# Altium schematic sheet Collection.SchDoc
size A; SheetNumber: 1; SheetTotal: 4
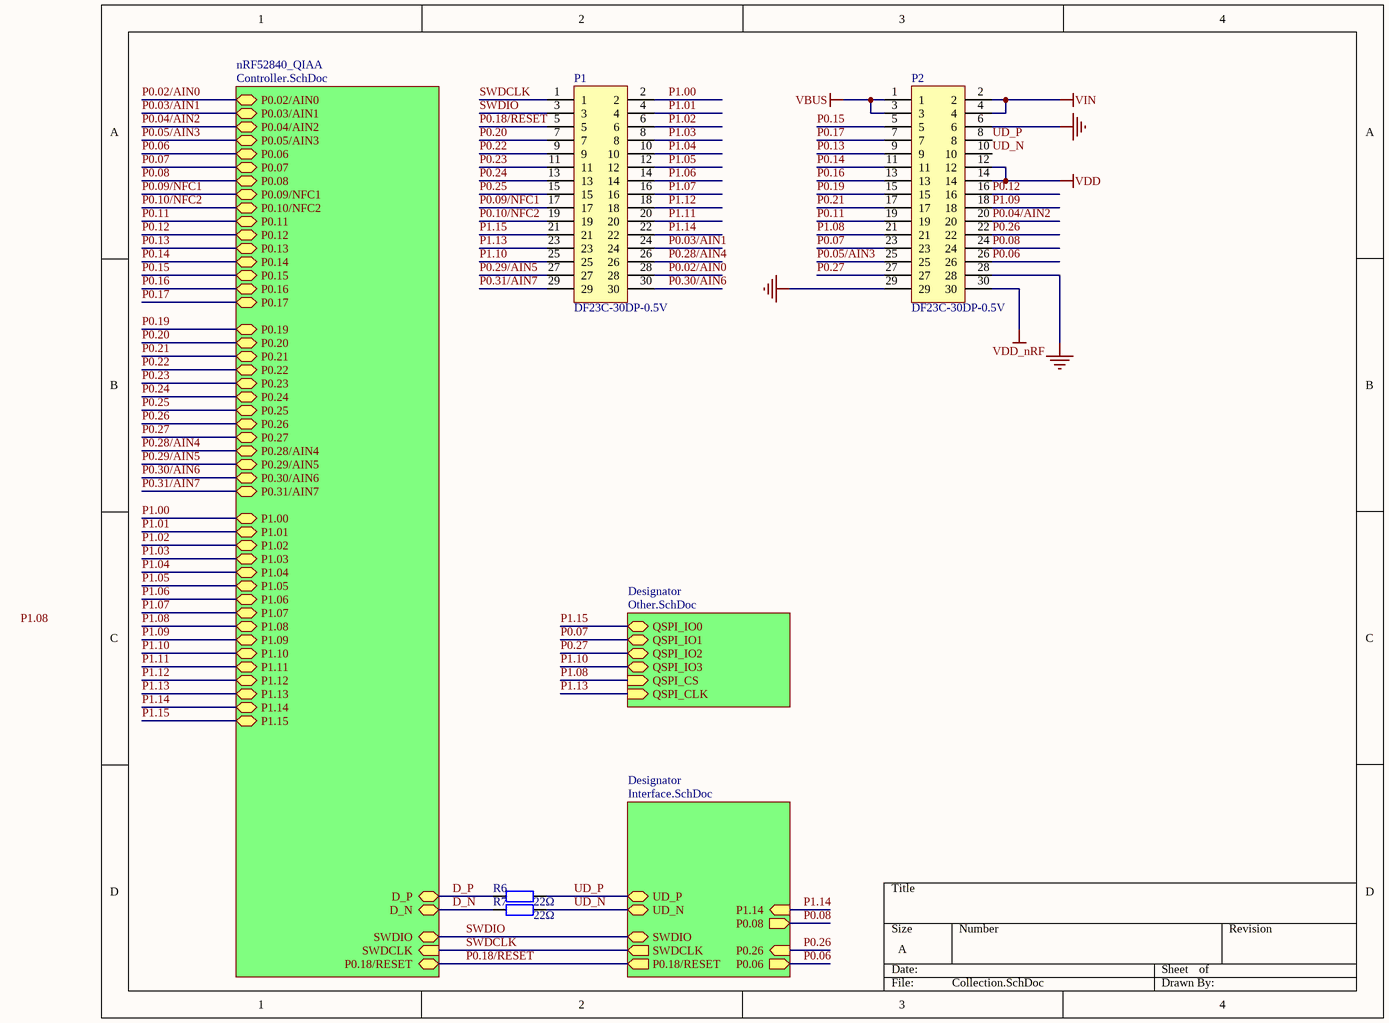
[diagram p0: Collection.SchDoc]

## Parts
P1  DF23C-30DP-0.5V  [DF23C-30DP-0.5V]
P2  DF23C-30DP-0.5V  [DF23C-30DP-0.5V]
R6  value 22Ω  [0402_R]  (hidden comment: 22Ω (22R0) ±1%)
R7  value 22Ω  [0402_R]  (hidden comment: 22Ω (22R0) ±1%)

## Sub-sheets
Designator = Interface.SchDoc: UD_P (bidir), UD_N (bidir), SWDCLK (out), SWDIO (bidir), P0.06 (out), P0.26 (in), P1.14 (in), P0.08 (out), P0.18/RESET (out)
Designator = Other.SchDoc: QSPI_IO0 (bidir), QSPI_IO1 (bidir), QSPI_IO2 (bidir), QSPI_IO3 (bidir), QSPI_CS (in), QSPI_CLK (in)
nRF52840_QIAA = Controller.SchDoc: P0.02/AIN0 (bidir), P0.03/AIN1 (bidir), P0.04/AIN2 (bidir), P0.05/AIN3 (bidir), P0.06 (bidir), P0.07 (bidir), P0.08 (bidir), D_P (bidir), D_N (bidir), P0.11 (bidir), P0.12 (bidir), P0.13 (bidir), P0.14 (bidir), P0.15 (bidir), P0.16 (bidir), P0.17 (bidir), P0.18/RESET (bidir), P0.19 (bidir), P0.20 (bidir), P0.21 (bidir), P0.22 (bidir), P0.23 (bidir), P0.24 (bidir), P0.25 (bidir), P0.26 (bidir), P0.27 (bidir), P0.28/AIN4 (bidir), P0.29/AIN5 (bidir), P0.30/AIN6 (bidir), P0.31/AIN7 (bidir), P1.00 (bidir), P1.01 (bidir), P1.02 (bidir), P1.03 (bidir), P1.04 (bidir), P1.05 (bidir), P1.06 (bidir), P1.07 (bidir), P1.08 (bidir), P1.09 (bidir), P1.10 (bidir), P1.11 (bidir), P1.12 (bidir), P1.13 (bidir), P1.14 (bidir), P1.15 (bidir), SWDCLK (in), SWDIO (bidir), P0.10/NFC2 (bidir), P0.09/NFC1 (bidir)

## Nets
GND: P2.6 P2.28 P2.29
VBUS: P2.1 P2.3
VDD: P2.12 P2.14
VDD_nRF: P2.30
VIN: P2.2 P2.4
D_N: R7.1 ; sheet nRF52840_QIAA/D_N
D_P: R6.1 ; sheet nRF52840_QIAA/D_P
P0.02/AIN0: P1.28 ; sheet nRF52840_QIAA/P0.02/AIN0
P0.03/AIN1: P1.24 ; sheet nRF52840_QIAA/P0.03/AIN1
P0.04/AIN2: P2.20 ; sheet nRF52840_QIAA/P0.04/AIN2
P0.05/AIN3: P2.25 ; sheet nRF52840_QIAA/P0.05/AIN3
P0.06: P2.26 ; sheet nRF52840_QIAA/P0.06, sheet Designator/P0.06
P0.07: P2.23 ; sheet nRF52840_QIAA/P0.07, sheet Designator/QSPI_IO1
P0.08: P2.24 ; sheet nRF52840_QIAA/P0.08, sheet Designator/P0.08
P0.09/NFC1: P1.17 ; sheet nRF52840_QIAA/P0.09/NFC1
P0.10/NFC2: P1.19 ; sheet nRF52840_QIAA/P0.10/NFC2
P0.11: P2.19 ; sheet nRF52840_QIAA/P0.11
P0.12: P2.16 ; sheet nRF52840_QIAA/P0.12
P0.13: P2.9 ; sheet nRF52840_QIAA/P0.13
P0.14: P2.11 ; sheet nRF52840_QIAA/P0.14
P0.15: P2.5 ; sheet nRF52840_QIAA/P0.15
P0.16: P2.13 ; sheet nRF52840_QIAA/P0.16
P0.17: P2.7 ; sheet nRF52840_QIAA/P0.17
P0.18/RESET: P1.5 ; sheet nRF52840_QIAA/P0.18/RESET, sheet Designator/P0.18/RESET
P0.19: P2.15 ; sheet nRF52840_QIAA/P0.19
P0.20: P1.7 ; sheet nRF52840_QIAA/P0.20
P0.21: P2.17 ; sheet nRF52840_QIAA/P0.21
P0.22: P1.9 ; sheet nRF52840_QIAA/P0.22
P0.23: P1.11 ; sheet nRF52840_QIAA/P0.23
P0.24: P1.13 ; sheet nRF52840_QIAA/P0.24
P0.25: P1.15 ; sheet nRF52840_QIAA/P0.25
P0.26: P2.22 ; sheet nRF52840_QIAA/P0.26, sheet Designator/P0.26
P0.27: P2.27 ; sheet nRF52840_QIAA/P0.27, sheet Designator/QSPI_IO2
P0.28/AIN4: P1.26 ; sheet nRF52840_QIAA/P0.28/AIN4
P0.29/AIN5: P1.27 ; sheet nRF52840_QIAA/P0.29/AIN5
P0.30/AIN6: P1.30 ; sheet nRF52840_QIAA/P0.30/AIN6
P0.31/AIN7: P1.29 ; sheet nRF52840_QIAA/P0.31/AIN7
P1.00: P1.2 ; sheet nRF52840_QIAA/P1.00
P1.01: P1.4 ; sheet nRF52840_QIAA/P1.01
P1.02: P1.6 ; sheet nRF52840_QIAA/P1.02
P1.03: P1.8 ; sheet nRF52840_QIAA/P1.03
P1.04: P1.10 ; sheet nRF52840_QIAA/P1.04
P1.05: P1.12 ; sheet nRF52840_QIAA/P1.05
P1.06: P1.14 ; sheet nRF52840_QIAA/P1.06
P1.07: P1.16 ; sheet nRF52840_QIAA/P1.07
P1.08: P2.21 ; sheet nRF52840_QIAA/P1.08, sheet Designator/QSPI_CS
P1.09: P2.18 ; sheet nRF52840_QIAA/P1.09
P1.10: P1.25 ; sheet nRF52840_QIAA/P1.10, sheet Designator/QSPI_IO3
P1.11: P1.20 ; sheet nRF52840_QIAA/P1.11
P1.12: P1.18 ; sheet nRF52840_QIAA/P1.12
P1.13: P1.23 ; sheet nRF52840_QIAA/P1.13, sheet Designator/QSPI_CLK
P1.14: P1.22 ; sheet nRF52840_QIAA/P1.14, sheet Designator/P1.14
P1.15: P1.21 ; sheet nRF52840_QIAA/P1.15, sheet Designator/QSPI_IO0
SWDCLK: P1.1 ; sheet nRF52840_QIAA/SWDCLK, sheet Designator/SWDCLK
SWDIO: P1.3 ; sheet nRF52840_QIAA/SWDIO, sheet Designator/SWDIO
UD_N: P2.10 R7.2 ; sheet Designator/UD_N
UD_P: P2.8 R6.2 ; sheet Designator/UD_P

## Notes on the sheet
- Labels drawn without touching a wire or pin: P1.08

## Library data of the parts
R6 R7 = 0402 22Ω (22R0) 1%: Chip Resistor